# Altium project UF_Servo.PrjPcb (part 8 of 8)

## Sheet DAC.SchDoc: DAC
size A3; Author: M.Beldyga; CompanyName: WUT ISE; DrawnBy: M.Beldyga; Organization: WUT ISE; Address1: PW ISE; Address2: Nowowiejska 15/19 00-665 Warsaw; Address3: micbeldyga@gmail.com; SheetNumber: 5; SheetTotal: 12; ModifiedBy: -; CheckedDate: -; Title2: 12b 16ch; DivGrp: WUT ISE; Designer: M.Beldyga; ModifiedDate: -; ProjectName: Sensor Box
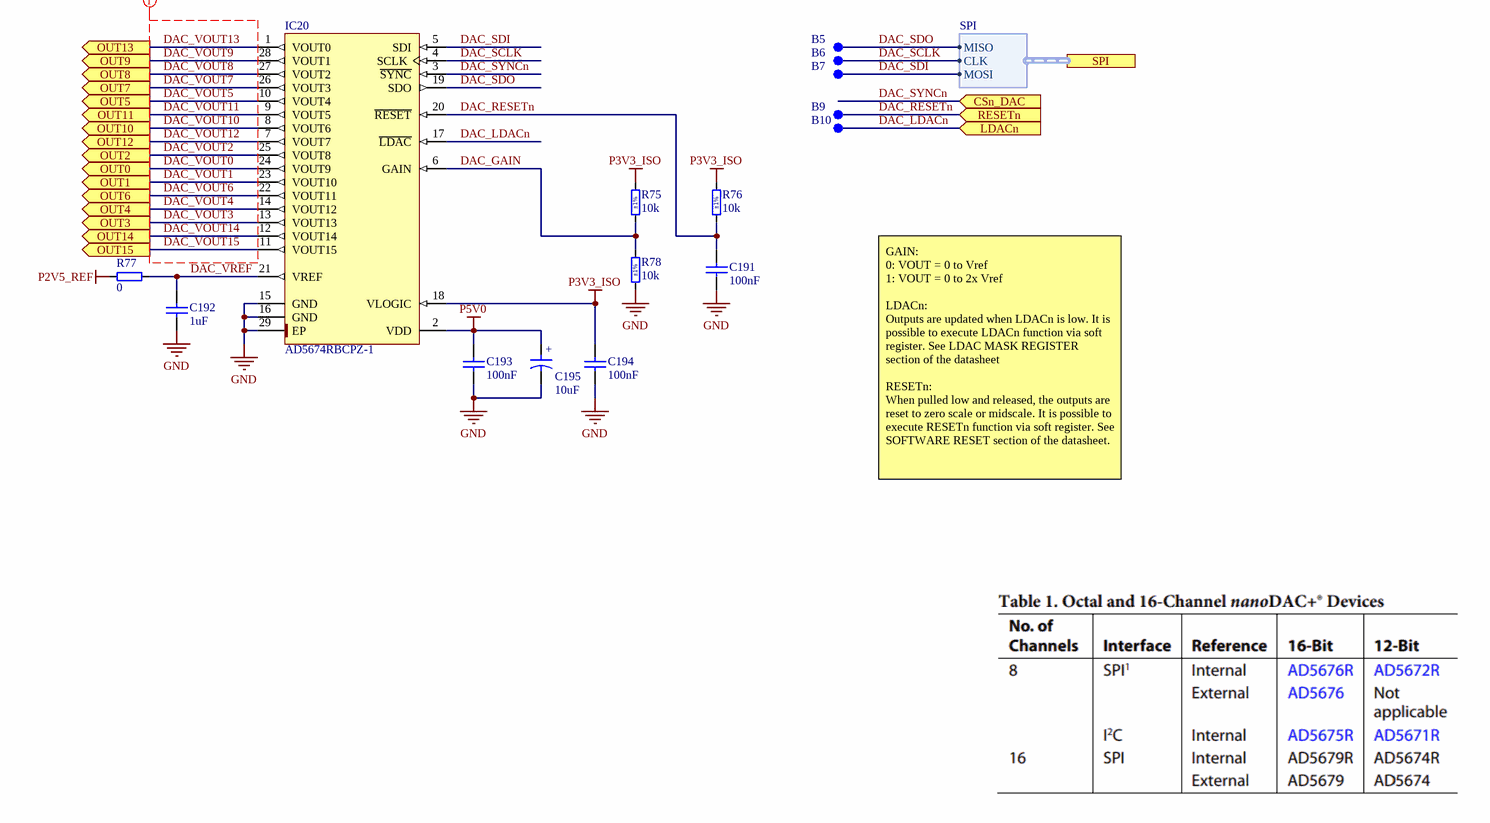
[diagram p11: DAC.SchDoc]

### Parts
B5  SMD Pad  [C100]  (value not drawn)  (no BOM)
B6  SMD Pad  [C100]  (value not drawn)  (no BOM)
B7  SMD Pad  [C100]  (value not drawn)  (no BOM)
B9  SMD Pad  [C100]  (value not drawn)  (no BOM)
B10  SMD Pad  [C100]  (value not drawn)  (no BOM)
C191  100nF  [CAPC1005X55N]
C192  1uF  [CAPC1005X55N]
C193  100nF  [CAPC1005X55N]
C194  100nF  [CAPC1005X55N]
C195  10uF  [CAPMP3216X180N]
IC20  AD5674RBCPZ-1  [QFN40P400X400X100-29N-S270]
R75  10k  Tolerance: ±1%  [RESC1005X40N]
R76  10k  Tolerance: ±1%  [RESC1005X40N]
R77  0  [RESC1005X40N]
R78  10k  Tolerance: ±1%  [RESC1005X40N]

### Ports
CSn_DAC (in), LDACn (in), OUT0 (out), OUT1 (out), OUT2 (out), OUT3 (out), OUT4 (out), OUT5 (out), OUT6 (out), OUT7 (out), OUT8 (out), OUT9 (out), OUT10 (out), OUT11 (out), OUT12 (out), OUT13 (out), OUT14 (out), OUT15 (out), RESETn (in), SPI (harness SPI)

### Harnesses
SPI: CLK, MOSI, MISO

### Nets
GND: C191.1 C192.1 C193.1 C194.1 C195.2 IC20.15(GND) IC20.16(GND) IC20.29(EP) R78.1
P2V5_REF: R77.1
P3V3_ISO: C194.2 IC20.18(VLOGIC) R75.2 R76.2
P5V0: C193.2 C195.1 IC20.2(VDD)
DAC_GAIN: IC20.6(GAIN) R75.1 R78.2
DAC_LDACn: B10.1 IC20.17(~{LDAC}) ; port LDACn
DAC_RESETn: B9.1 C191.2 IC20.20(~{RESET}) R76.1 ; port RESETn
DAC_SCLK: B6.1 IC20.4(SCLK) ; port SPI.CLK
DAC_SDI: B7.1 IC20.5(SDI) ; port SPI.MOSI
DAC_SDO: B5.1 IC20.19(SDO) ; port SPI.MISO
DAC_SYNCn: IC20.3(~{SYNC}) ; port CSn_DAC  [project net CSn_DAC]
DAC_VOUT0: IC20.24(VOUT9) ; port OUT0
DAC_VOUT1: IC20.23(VOUT10) ; port OUT1
DAC_VOUT2: IC20.25(VOUT8) ; port OUT2
DAC_VOUT3: IC20.13(VOUT13) ; port OUT3
DAC_VOUT4: IC20.14(VOUT12) ; port OUT4
DAC_VOUT5: IC20.10(VOUT4) ; port OUT5
DAC_VOUT6: IC20.22(VOUT11) ; port OUT6
DAC_VOUT7: IC20.26(VOUT3) ; port OUT7
DAC_VOUT8: IC20.27(VOUT2) ; port OUT8
DAC_VOUT9: IC20.28(VOUT1) ; port OUT9
DAC_VOUT10: IC20.8(VOUT6) ; port OUT10
DAC_VOUT11: IC20.9(VOUT5) ; port OUT11
DAC_VOUT12: IC20.7(VOUT7) ; port OUT12
DAC_VOUT13: IC20.1(VOUT0) ; port OUT13
DAC_VOUT14: IC20.12(VOUT14) ; port OUT14
DAC_VOUT15: IC20.11(VOUT15) ; port OUT15
DAC_VREF: C192.2 IC20.21(VREF) R77.2

### Layout directives
net class DAC: DAC_VOUT0, DAC_VOUT1, DAC_VOUT2, DAC_VOUT3, DAC_VOUT4, DAC_VOUT5, DAC_VOUT6, DAC_VOUT7, DAC_VOUT8, DAC_VOUT9, DAC_VOUT10, DAC_VOUT11, DAC_VOUT12, DAC_VOUT13, DAC_VOUT14, DAC_VOUT15

### Notes on the sheet
- GAIN:
  0: VOUT = 0 to Vref
  1: VOUT = 0 to 2x Vref
  LDACn:
  Outputs are updated when LDACn is low. It is possible to execute LDACn function via soft register. See LDAC MASK REGISTER section of the datasheet
  RESETn:
  When pulled low and released, the outputs are reset to zero scale or midscale. It is possible to execute RESETn function via soft register. See SOFTWARE RESET section of the datasheet.
- Project/Equipment
- Document
- Designer
- Drawn by
- Check.by
- Contact
- File
- Last Mod.
- Print Date
- Sheet
- Size
- A3
- of
- Rev
- (in symbol CTE3216-18_10UF_16V_20%_AVX_TCJ) +

### Library data of the parts
B5-B7 B9 B10 = SMD_PAD_D1MM: as B1-B4 on sheet Isolated_Power_supply; Part Number: SMD_PAD_D1MM; Component Type: Standard (No BOM); Pin Count: 1; Family: SMD Pad; Socket: No; SMD: Yes; Sense: No; Status: None; ComponentHeight: 0mm; HelpURL: Undefined; Author: CERN DEM JLC; CreateDate: 10/10/2017; LatestRevisionDate: 10/10/2017; PackageDescription: 1mm Diameter SMD Pad
C191 C193 C194 = CC0402_100NF_50V_10%_X7R: Non-polarised capacitor; Part Description: SMD Multilayer Chip Ceramic Capacitor; Manufacturer: GENERIC; Manufacturer1 Part Number: GRM155R71H104KE14D; Voltage: 50V; TC: X7R; Tolerance: ±10%; Part Number: CC0402_100NF_50V_10%_X7R; Component Kind: Standard; Component Type: Standard; Pin Count: 2; Value: 100nF; Status: None; Manufacturer Part Number: CC0402_100NF_50V_10%_X7R; Case: 0402; Mounted: Yes; Socket: No; SMD: Yes; Sense: No; Manufacturer1 Example: MURATA; Manufacturer1 ComponentHeight: 0.55mm; HelpURL: \\cern.ch\dfs\Applications\Altium\Datasheets\CC0402_MURATA_GRM155R71H104KE14D.pdf; Author: CERN DEM MR; CreateDate: 6/30/2017; LatestRevisionDate: 6/30/2017
C192 = CC0402_1UF_16V_10%_X5R: Non-polarised capacitor; Part Description: SMD Multilayer Chip Ceramic Capacitor; Manufacturer: GENERIC; Manufacturer1 Part Number: C1005X5R1C105KT; Voltage: 16V; TC: X5R; Tolerance: ±10%; Part Number: CC0402_1UF_16V_10%_X5R; Component Kind: Standard; Component Type: Standard; Pin Count: 2; Value: 1uF; Status: Preferred; Manufacturer Part Number: CC0402_1UF_16V_10%_X5R; Case: 0402; Mounted: Yes; Socket: No; SMD: Yes; Sense: No; Manufacturer1 Example: TDK; Manufacturer1 ComponentHeight: 0.55mm; HelpURL: \\cern.ch\dfs\Applications\Altium\Datasheets\CC0402_X5R_TDK_C.pdf; Author: CERN DEM JLC; CreateDate: 10/25/2012; LatestRevisionDate: 10/25/2012
C195 = CTE3216-18_10UF_16V_20%_AVX_TCJ: Polarised capacitor; Part Description: ESR 0R200 Tantalum Solid Electrolytic Chip Capacitor with Conductive Polymer Electrode; Manufacturer: AVX; Manufacturer Part Number: TCJA106M016R0200; Voltage: 16V; Tolerance: ±20%; Part Number: CTE3216-18_10UF_16V_20%_AVX_TCJ; Component Kind: Standard; Component Type: Standard; Pin Count: 2; Value: 10uF; Status: Preferred; Case: A; Mounted: Yes; Socket: No; SMD: Yes; Sense: No; ComponentHeight: 1.8mm; HelpURL: \\cern.ch\dfs\Applications\Altium\Datasheets\CTE_AVX_TCJ.pdf; Author: CERN DEM JLC; CreateDate: 29.03.2012; LatestRevisionDate: 29.03.2012
IC20 = AD5674RBCPZ-1: 12-Bit nanoDAC+ with 2 ppm/°C Voltage Reference Temperature Coefficient, SPI Interface; Manufacturer: ANALOG DEVICES; PressFit: No; Bonding: No; Part Number: AD5674RBCPZ-1; Component Kind: Standard; Component Type: Standard; Device: AD5674RBCPZ-1; PackageDescription: QFN, 0.40mm Pitch, Square; 28 Pin, 4.00mm L X 4.00mm W X 1.00mm H body (w/Thermal Tab 2.70 X 2.70mm), IPC Medium Density; Part Description: 12-Bit nanoDAC+ with 2 ppm/°C Voltage Reference Temperature Coefficient, SPI Interface; Manufacturer Part Number: AD5674RBCPZ-1; Pin Count: 28; Case: QFN28; Mounted: Yes; Socket: No; SMD: Yes; Sense: No; ComponentHeight: 1.0mm; Author: CERN DEM HF; HelpURL: \\cern.ch\dfs\Applications\Altium\Datasheets\AD5674RBCPZ-1.pdf; CreateDate: 4/19/2022; LatestRevisionDate: 4/19/2022
R75 R76 R78 = R0402_10K_1%_0.0625W_100PPM: Resistor - 1%; Part Description: General Purpose Thick Film Chip Resistor; Manufacturer: GENERIC; Manufacturer1 Part Number: 232270671003L; TC: ±100ppm/°C; PressFit: No; Part Number: R0402_10K_1%_0.0625W_100PPM; Component Kind: Standard; Component Type: Standard; Pin Count: 2; Value: 10k; Status: Not Recommended; Power: 0.0625W; Manufacturer Part Number: R0402_10K_1%_0.0625W_100PPM; Case: 0402; Mounted: Yes; Sense: No; Socket: No; SMD: Yes; Manufacturer1 Example: YAGEO PHYCOMP; Manufacturer1 ComponentHeight: 0.4mm; HelpURL: \\cern.ch\dfs\Applications\Altium\Datasheets\R0402_Phycomp_RC0402.pdf; Author: CERN DEM JLC; CreateDate: 12/3/2007; LatestRevisionDate: 10/17/2012
R77 = R0402_0R_JUMPER: Resistor; Part Description: 1A (0.05R Max DC Resistance) Zero Ohm Jumper; Manufacturer: GENERIC; Manufacturer1 Part Number: 232270591001L; PressFit: No; Part Number: R0402_0R_JUMPER; Component Kind: Standard; Component Type: Standard; Pin Count: 2; Value: 0; Status: Not Recommended; Manufacturer Part Number: R0402_0R_JUMPER; Case: 0402; Mounted: Yes; Sense: No; Socket: No; SMD: Yes; Manufacturer1 Example: YAGEO PHYCOMP; Manufacturer1 ComponentHeight: 0.4mm; HelpURL: \\cern.ch\dfs\Applications\Altium\Datasheets\R0402_Phycomp_RC0402.pdf; Author: CERN DEM JLC; CreateDate: 12/3/2007; LatestRevisionDate: 10/17/2012

## Sheet Phase_Detector.SchDoc: Phase detector
size A3; Author: M.Beldyga; CompanyName: WUT ISE; DrawnBy: M.Beldyga; Organization: WUT ISE; Address1: PW ISE; Address2: Nowowiejska 15/19 00-665 Warsaw; Address3: micbeldyga@gmail.com; SheetNumber: 12; SheetTotal: 12; ModifiedBy: -; CheckedDate: -; DivGrp: WUT ISE; Designer: M.Beldyga; ModifiedDate: -; ProjectName: Sensor Box
Used 2 times, as channels U_Phase_Detector, U_Phase_Detector. Parts and nets are listed once, with the designators drawn on the sheet.
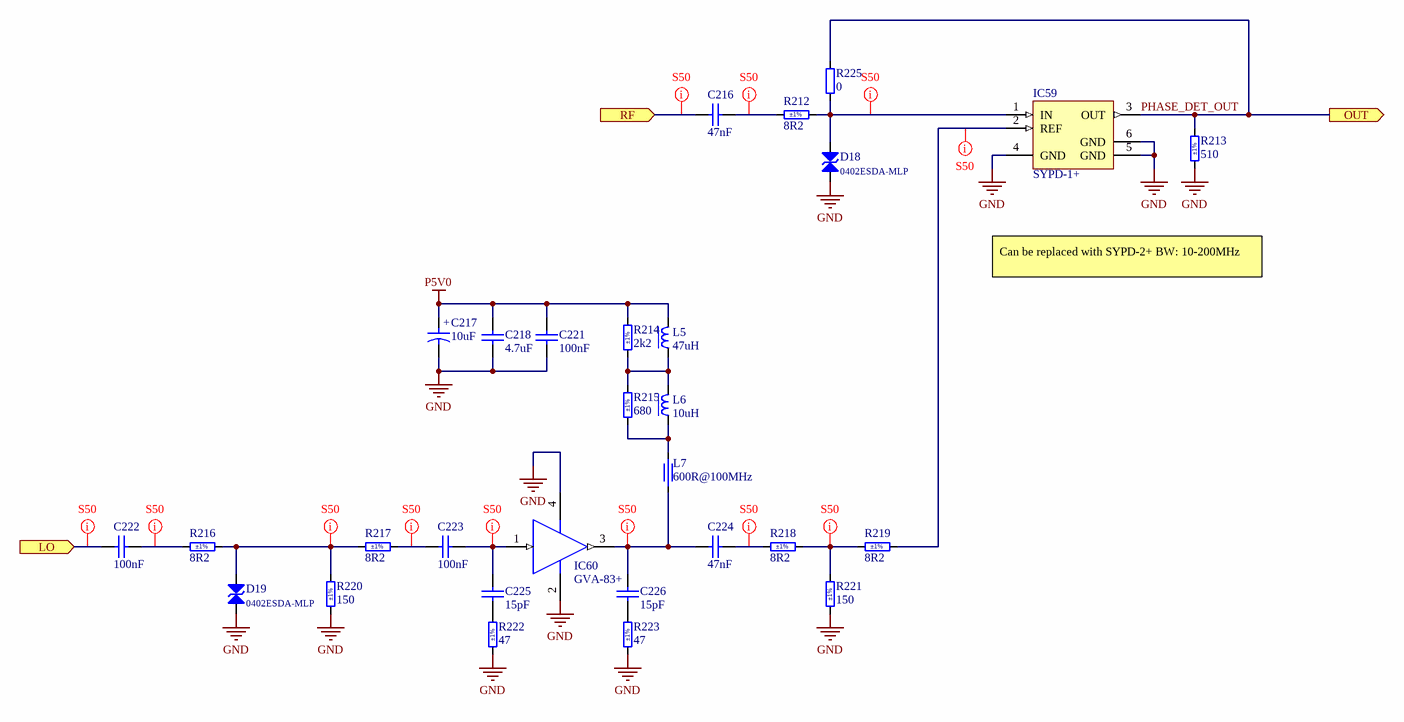
[diagram p12: Phase_Detector.SchDoc]

### Parts
C216  47nF  [CAPC1005X55N]
C217  10uF  [CAPMP3216X180N]
C218  4.7uF  [CAPC1608X90N]
C221  100nF  [CAPC1005X55N]
C222  100nF  [CAPC1005X55N]
C223  100nF  [CAPC1005X55N]
C224  47nF  [CAPC1005X55N]
C225  15pF  [CAPC1005X55N]
C226  15pF  [CAPC1005X55N]
D18  0402ESDA-MLP  [EATON_0402ESDA-MLP]
D19  0402ESDA-MLP  [EATON_0402ESDA-MLP]
IC59  SYPD-1+  [MINI-CIRCUITS_TTT167]
IC60  GVA-83+  [MINI-CIRCUITS_DF782]
L5  47uH  [IND_MURATA_LQH32C]
L6  10uH  [IND_MURATA_LQH32C]
L7  600R@100MHz  [INDC1608X95N]
R212  8R2  Tolerance: ±1%  [RESC2012X60N]
R213  510  Tolerance: ±1%  [RESC1005X40N]
R214  2k2  Tolerance: ±1%  [RESC1005X40N]
R215  680  Tolerance: ±1%  [RESC1005X40N]
R216  8R2  Tolerance: ±1%  [RESC2012X60N]
R217  8R2  Tolerance: ±1%  [RESC2012X60N]
R218  8R2  Tolerance: ±1%  [RESC2012X60N]
R219  8R2  Tolerance: ±1%  [RESC2012X60N]
R220  150  Tolerance: ±1%  [RESC2012X60N]
R221  150  Tolerance: ±1%  [RESC2012X60N]
R222  47  Tolerance: ±1%  [RESC1005X40N]
R223  47  Tolerance: ±1%  [RESC1005X40N]
R225  0  [RESC1005X40N]

### Ports
LO (in), OUT (out), RF (in)

### Nets
GND: C217.2 C218.1 C221.2 D18.1 D19.1 IC59.4(GND) IC59.5(GND) IC59.6(GND) IC60.2(GND) IC60.4(GND) R213.1 R220.1 R221.1 R222.1 R223.1
P5V0: C217.1 C218.2 C221.1 L5.2 R214.2
LO: C222.2 ; port LO
PHASE_DET_OUT: IC59.3(OUT) R213.2 R225.2 ; port OUT
RF: C216.1 ; port RF
NetC216_2: C216.2 R212.1
NetC222_1: C222.1 R216.1
NetC223_1: C223.1 C225.2 IC60.1(RF_IN)
NetC223_2: C223.2 R217.2
NetC224_1: C224.1 C226.2 IC60.3(RF_OUT) L7.1
NetC224_2: C224.2 R218.1
NetC225_1: C225.1 R222.2
NetC226_1: C226.1 R223.2
NetD18_2: D18.2 IC59.1(IN) R212.2 R225.1
NetD19_2: D19.2 R216.2 R217.1 R220.2
NetIC59_2: IC59.2(REF) R219.2
NetL5_1: L5.1 L6.2 R214.1 R215.2
NetL6_1: L6.1 L7.2 R215.1
NetR218_2: R218.2 R219.1 R221.2

### Channels
U_Phase_Detector: designators C216=C216B C217=C217B C218=C218B C221=C221B C222=C222B C223=C223B C224=C224B C225=C225B C226=C226B D18=D18B D19=D19B IC59=IC59B IC60=IC60A L5=L5B L6=L6B L7=L7B R212=R212B R213=R213B R214=R214B R215=R215B R216=R216B R217=R217B R218=R218B R219=R219B R220=R220B R221=R221B R222=R222B R223=R223B R225=R225B; ports LO=LO_IN_B OUT=PHASE_DET_OUT RF=RF_IN_B
U_Phase_Detector: designators C216=C216A C217=C217A C218=C218A C221=C221A C222=C222A C223=C223A C224=C224A C225=C225A C226=C226A D18=D18A D19=D19A IC59=IC59A IC60=IC60B L5=L5A L6=L6A L7=L7A R212=R212A R213=R213A R214=R214A R215=R215A R216=R216A R217=R217A R218=R218A R219=R219A R220=R220A R221=R221A R222=R222A R223=R223A R225=R225A; ports LO=LO_IN_A OUT=PHASE_DET_OUT RF=RF_IN_A

### Layout directives
net class S50: LO_IN_B, NetC216B_2, NetC222B_1, NetC223B_1, NetC223B_2, NetC224B_1, NetC224B_2, NetD18B_2, NetD19B_2, NetIC59B_2, NetR218B_2, RF_IN_B

### Notes on the sheet
- Can be replaced with SYPD-2+ BW: 10-200MHz
- Project/Equipment
- Document
- Designer
- Drawn by
- Check.by
- Contact
- File
- Last Mod.
- Print Date
- Sheet
- Size
- A3
- of
- Rev
- (in symbol CTE3216-18_10UF_10V_10%_LESR1800) +

### Library data of the parts
C216 C224 = CC0402_47NF_25V_10%_X7R: Non-polarised capacitor; Part Description: SMD Multilayer Chip Ceramic Capacitor; Manufacturer: GENERIC; Manufacturer1 Part Number: C1005X7R1E473K050; Voltage: 25V; TC: X7R; Tolerance: ±10%; Part Number: CC0402_47NF_25V_10%_X7R; Component Kind: Standard; Component Type: Standard; Pin Count: 2; Value: 47nF; Status: Preferred; Manufacturer Part Number: CC0402_47NF_25V_10%_X7R; Case: 0402; Mounted: Yes; Socket: No; SMD: Yes; Sense: No; Manufacturer1 Example: TDK; Manufacturer1 ComponentHeight: 0.55mm; HelpURL: \\cern.ch\dfs\Applications\Altium\Datasheets\CC0402_X7R_TDK_C.pdf; Author: CERN DEM JLC; CreateDate: 10/25/2012; LatestRevisionDate: 10/25/2012
C217 = CTE3216-18_10UF_10V_10%_LESR1800: Polarised capacitor; Part Description: Low ESR 1R8 Solid Tantalum Chip Capacitor; Manufacturer: GENERIC; Manufacturer1 Part Number: TPSA106K010R1800; Voltage: 10V; Tolerance: ±10%; Part Number: CTE3216-18_10UF_10V_10%_LESR1800; Component Kind: Standard; Component Type: Standard; Pin Count: 2; Value: 10uF; Status: Preferred; Manufacturer Part Number: CTE3216-18_10UF_10V_10%_LESR1800; Case: A; Mounted: Yes; Socket: No; SMD: Yes; Sense: No; Manufacturer1 Example: AVX; Manufacturer1 ComponentHeight: 1.8mm; HelpURL: \\cern.ch\dfs\Applications\Altium\Datasheets\CTE-LESR_AVX_TPS.pdf; Author: CERN DEM JLC; CreateDate: 5/5/2008; LatestRevisionDate: 1/20/2009
C218 = CC0603_4.7UF_25V_10%_X5R: Non-polarised capacitor; Part Description: SMD Multilayer Chip Ceramic Capacitor; Manufacturer: GENERIC; Manufacturer1 Part Number: GRM188R61E475KE11D; Voltage: 25V; TC: X5R; Tolerance: ±10%; Part Number: CC0603_4.7UF_25V_10%_X5R; Component Kind: Standard; Component Type: Standard; Pin Count: 2; Value: 4.7uF; Status: None; Manufacturer Part Number: CC0603_4.7UF_25V_10%_X5R; Case: 0603; Mounted: Yes; Socket: No; SMD: Yes; Sense: No; Manufacturer1 Example: MURATA; Manufacturer1 ComponentHeight: 0.95mm; HelpURL: \\cern.ch\dfs\Applications\Altium\Datasheets\CC0603_MURATA_GRM188R61E475KE11D.pdf; Author: CERN DEM JLC; CreateDate: 11/10/2014; LatestRevisionDate: 11/10/2014
C221-C223 = CC0402_100NF_50V_10%_X7R: as C191 on sheet DAC; Part Number: CC0402_100NF_50V_10%_X7R; Component Kind: Standard; Component Type: Standard; Pin Count: 2; Value: 100nF; Status: None; Manufacturer Part Number: CC0402_100NF_50V_10%_X7R; Case: 0402; Mounted: Yes; Socket: No; SMD: Yes; Sense: No; Manufacturer1 Example: MURATA; Manufacturer1 ComponentHeight: 0.55mm; HelpURL: \\cern.ch\dfs\Applications\Altium\Datasheets\CC0402_MURATA_GRM155R71H104KE14D.pdf; Author: CERN DEM MR; CreateDate: 6/30/2017; LatestRevisionDate: 6/30/2017
C225 C226 = CC0402_15PF_50V_5%_C0G: Non-polarised capacitor; Part Description: SMD Multilayer Chip Ceramic Capacitor; Manufacturer: GENERIC; Manufacturer1 Part Number: C0402C150J5GACTU; Voltage: 50V; TC: C0G/NP0; Tolerance: ±5%; Part Number: CC0402_15PF_50V_5%_C0G; Component Kind: Standard; Component Type: Standard; Pin Count: 2; Value: 15pF; Status: Preferred; Manufacturer Part Number: CC0402_15PF_50V_5%_C0G; Case: 0402; Mounted: Yes; Socket: No; SMD: Yes; Sense: No; Manufacturer1 Example: KEMET; Manufacturer1 ComponentHeight: 0.55mm; HelpURL: \\cern.ch\dfs\Applications\Altium\Datasheets\CC0402_C0G_KEMET_(Commercial Grade).pdf; Author: CERN DEM JLC; CreateDate: 12/3/2007; LatestRevisionDate: 4/22/2015
D18 D19 = 0402ESDA-MLP: Transient Voltage Suppressor Diode (Bi-Directional); Part Description: 0.05pF 8kV Bidirectional ESD Voltage Suppressor; Manufacturer: EATON; Voltage: 8kV; PressFit: No; Bonding: No; Part Number: 0402ESDA-MLP; Component Kind: Standard; Component Type: Standard; Device: 0402ESDA-MLP; PackageDescription: 0402, 2-Leads, Body 1.1mm L X 0.53mm W X 0.44mm H body, IPC Medium Density; Manufacturer Part Number: 0402ESDA-MLP; Pin Count: 2; Case: 0402; Mounted: Yes; Socket: No; SMD: Yes; Sense: No; ComponentHeight: 0.44mm; HelpURL: \\cern.ch\dfs\Applications\Altium\Datasheets\0402ESDA-MLP.pdf; Author: CERN DEM MR; CreateDate: 11/22/2019; LatestRevisionDate: 11/22/2019
IC59 = SYPD-1+: 50 Ohm, 1 to 100MHz, High Output, Phase Detector; Manufacturer: MINI-CIRCUITS; Manufacturer Part Number: SYPD-1; PressFit: No; Bonding: No; Part Number: SYPD-1+; Component Kind: Standard; Component Type: Standard; Device: SYPD-1+; PackageDescription: MINI-CIRCUITS TTT167 Case, 6 pin, 9.65mm W X 12.7mm L; Part Description: 50 Ohm, 1 to 100MHz, High Output, Phase Detector; Pin Count: 6; Mounted: Yes; Socket: No; SMD: Yes; Sense: No; ComponentHeight: 5.84mm; Author: CERN DEM BC; HelpURL: \\cern.ch\dfs\Applications\Altium\Datasheets\SYPD-1+.pdf; CreateDate: 1/23/2020; LatestRevisionDate: 6/24/2022
IC60 = GVA-83+: Monolithic Amplifier DC-7 GHz; Manufacturer: Mini-Circuits; Supplier: Digikey; Supplier Part Number: 3157-GVA-83+CT-ND; Manufacturer Part Number: GVA-83+; RoHS: Yes; Category: RF Amplifiers; Stock: 563; Pricing: 1=3.04, 20=2.76, 100=2.724, 200=2.592, 500=2.5857 (USD); RoHS Compliant: Yes; ComponentLink1URL: http://datasheet.octopart.com/GVA-83%2B-Mini-Circuits-datasheet-15989876.pdf?src-supplier=Digikey; ComponentLink1Description: http://datasheet.octopart.com/GVA-83%2B-Mini-Circuits-datasheet-15989876.pdf?src-supplier=Digikey; ComponentLink2URL: http://datasheet.octopart.com/GVA-83%2B-Mini-Circuits-datasheet-15989876.pdf?src-supplier=Mouser; ComponentLink2Description: http://datasheet.octopart.com/GVA-83%2B-Mini-Circuits-datasheet-15989876.pdf?src-supplier=Mouser; ComponentLink3URL: http://datasheet.octopart.com/GVA-83%2B-Mini-Circuits-datasheet-15989876.pdf?src-supplier=Quest; ComponentLink3Description: http://datasheet.octopart.com/GVA-83%2B-Mini-Circuits-datasheet-15989876.pdf?src-supplier=Quest
L5 = IND_47UH_10%_MURATA_LQH32CN470K23L: Inductor With Core; Part Description: Chip Inductor (Chip Coil) for Choke Wire Wound Type; Manufacturer: MURATA; Power: 170mA; Resistance: 1.3R; Tolerance: ±10%; Part Number: IND_47UH_10%_MURATA_LQH32CN470K23L; Component Kind: Standard; Component Type: Standard; Pin Count: 2; Value: 47uH; Manufacturer Part Number: LQH32CN470K23; Mounted: Yes; Socket: No; SMD: Yes; Sense: No; ComponentHeight: 2.2mm; HelpURL: \\cern.ch\dfs\Applications\Altium\Datasheets\IND_MURATA_LQH32CN_23.pdf; Author: CERN DEM JLC; CreateDate: 1/20/2009; LatestRevisionDate: 7/4/2018
L6 = IND_10UH_10%_MURATA_LQH32CN100K33L: Inductor With Core; Part Description: Chip Inductor (Chip Coil) for Choke Wire Wound Type; Manufacturer: MURATA; Power: 450mA; Resistance: 0.3R; Tolerance: ±10%; Part Number: IND_10UH_10%_MURATA_LQH32CN100K33L; Component Kind: Standard; Component Type: Standard; Pin Count: 2; Value: 10uH; Manufacturer Part Number: LQH32CN100K33; Mounted: Yes; Socket: No; SMD: Yes; Sense: No; ComponentHeight: 2.2mm; HelpURL: \\cern.ch\dfs\Applications\Altium\Datasheets\IND_MURATA_LQH32CN_33.pdf; Author: CERN DEM JLC; CreateDate: 4/6/2009; LatestRevisionDate: 7/4/2018
L7 = IND0603_MURATA_BLM18BD601SN1D: Part Description: SMD EMIFIL Suppression Chip Ferrite Bead; Manufacturer: MURATA; Power: 200mA; Resistance: 0.65R; Tolerance: ±25%; Part Number: IND0603_MURATA_BLM18BD601SN1D; Component Kind: Standard; Component Type: Standard; Pin Count: 2; Value: 600R@100MHz; Manufacturer Part Number: BLM18BD601SN1D; Case: 0603; Mounted: Yes; Socket: No; SMD: Yes; Sense: No; ComponentHeight: 0.95mm; HelpURL: \\cern.ch\dfs\Applications\Altium\Datasheets\IND0603_MURATA_BLM18B.pdf; Author: CERN DEM JLC; CreateDate: 7/4/2012; LatestRevisionDate: 10/25/2018
R212 R216-R219 = R0805_8R2_1%_0.125W_200PPM: Resistor - 1%; Part Description: General Purpose Thick Film Chip Resistor; Manufacturer: GENERIC; Manufacturer1 Part Number: 232273468208L or RC0805FR-078R2L; Power: 0.125W; TC: ±200ppm/°C; PressFit: No; Part Number: R0805_8R2_1%_0.125W_200PPM; Component Kind: Standard; Component Type: Standard; Pin Count: 2; Value: 8R2; Status: Preferred; Manufacturer Part Number: R0805_8R2_1%_0.125W_200PPM; Case: 0805; Mounted: Yes; Sense: No; Socket: No; SMD: Yes; Manufacturer1 Example: YAGEO PHYCOMP; Manufacturer1 ComponentHeight: 0.65mm; HelpURL: \\cern.ch\dfs\Applications\Altium\Datasheets\R0805_Phycomp_RC0805.pdf; Author: CERN DEM JLC; CreateDate: 12/3/2007; LatestRevisionDate: 10/17/2012
R213 = R0402_510R_1%_0.0625W_100PPM: Resistor - 1%; Part Description: General Purpose Thick Film Chip Resistor; Manufacturer: GENERIC; Manufacturer1 Part Number: 232270675101L; TC: ±100ppm/°C; PressFit: No; Part Number: R0402_510R_1%_0.0625W_100PPM; Component Kind: Standard; Component Type: Standard; Pin Count: 2; Value: 510; Status: Not Recommended; Power: 0.0625W; Manufacturer Part Number: R0402_510R_1%_0.0625W_100PPM; Case: 0402; Mounted: Yes; Sense: No; Socket: No; SMD: Yes; Manufacturer1 Example: YAGEO PHYCOMP; Manufacturer1 ComponentHeight: 0.4mm; HelpURL: \\cern.ch\dfs\Applications\Altium\Datasheets\R0402_Phycomp_RC0402.pdf; Author: CERN DEM JLC; CreateDate: 12/3/2007; LatestRevisionDate: 10/17/2012
R214 = R0402_2K2_1%_0.0625W_100PPM: Resistor - 1%; Part Description: General Purpose Thick Film Chip Resistor; Manufacturer: GENERIC; Manufacturer1 Part Number: 232270672202L; TC: ±100ppm/°C; PressFit: No; Part Number: R0402_2K2_1%_0.0625W_100PPM; Component Kind: Standard; Component Type: Standard; Pin Count: 2; Value: 2k2; Status: Not Recommended; Power: 0.0625W; Manufacturer Part Number: R0402_2K2_1%_0.0625W_100PPM; Case: 0402; Mounted: Yes; Sense: No; Socket: No; SMD: Yes; Manufacturer1 Example: YAGEO PHYCOMP; Manufacturer1 ComponentHeight: 0.4mm; HelpURL: \\cern.ch\dfs\Applications\Altium\Datasheets\R0402_Phycomp_RC0402.pdf; Author: CERN DEM JLC; CreateDate: 12/3/2007; LatestRevisionDate: 10/17/2012
R215 = R0402_680R_1%_0.0625W_100PPM: Resistor - 1%; Part Description: General Purpose Thick Film Chip Resistor; Manufacturer: GENERIC; Manufacturer1 Part Number: 232270676801L; TC: ±100ppm/°C; PressFit: No; Part Number: R0402_680R_1%_0.0625W_100PPM; Component Kind: Standard; Component Type: Standard; Pin Count: 2; Value: 680; Status: Not Recommended; Power: 0.0625W; Manufacturer Part Number: R0402_680R_1%_0.0625W_100PPM; Case: 0402; Mounted: Yes; Sense: No; Socket: No; SMD: Yes; Manufacturer1 Example: YAGEO PHYCOMP; Manufacturer1 ComponentHeight: 0.4mm; HelpURL: \\cern.ch\dfs\Applications\Altium\Datasheets\R0402_Phycomp_RC0402.pdf; Author: CERN DEM JLC; CreateDate: 12/3/2007; LatestRevisionDate: 10/17/2012
R220 R221 = R0805_150R_1%_0.125W_100PPM: Resistor - 1%; Part Description: General Purpose Thick Film Chip Resistor; Manufacturer: GENERIC; Manufacturer1 Part Number: NRC10F1500TRF; Power: 0.125W; TC: ±100ppm/°C; PressFit: No; Part Number: R0805_150R_1%_0.125W_100PPM; Component Kind: Standard; Component Type: Standard; Pin Count: 2; Value: 150; Status: Preferred; Manufacturer Part Number: R0805_150R_1%_0.125W_100PPM; Case: 0805; Mounted: Yes; Sense: No; Socket: No; SMD: Yes; Manufacturer1 Example: NIC COMPONENT; Manufacturer1 ComponentHeight: 0.6mm; HelpURL: \\cern.ch\dfs\Applications\Altium\Datasheets\R0805_NIC_NRC.pdf; Author: CERN DEM JLC; CreateDate: 12/3/2007; LatestRevisionDate: 3/13/2008
R222 R223 = R0402_47R_1%_0.0625W_100PPM: Resistor - 1%; Part Description: General Purpose Thick Film Chip Resistor; Manufacturer: GENERIC; Manufacturer1 Part Number: 232270674709L; TC: ±100ppm/°C; PressFit: No; Part Number: R0402_47R_1%_0.0625W_100PPM; Component Kind: Standard; Component Type: Standard; Pin Count: 2; Value: 47; Status: Not Recommended; Power: 0.0625W; Manufacturer Part Number: R0402_47R_1%_0.0625W_100PPM; Case: 0402; Mounted: Yes; Sense: No; Socket: No; SMD: Yes; Manufacturer1 Example: YAGEO PHYCOMP; Manufacturer1 ComponentHeight: 0.4mm; HelpURL: \\cern.ch\dfs\Applications\Altium\Datasheets\R0402_Phycomp_RC0402.pdf; Author: CERN DEM JLC; CreateDate: 12/3/2007; LatestRevisionDate: 10/17/2012
R225 = R0402_0R_JUMPER: as R77 on sheet DAC; Part Number: R0402_0R_JUMPER; Component Kind: Standard; Component Type: Standard; Pin Count: 2; Value: 0; Status: Not Recommended; Manufacturer Part Number: R0402_0R_JUMPER; Case: 0402; Mounted: Yes; Sense: No; Socket: No; SMD: Yes; Manufacturer1 Example: YAGEO PHYCOMP; Manufacturer1 ComponentHeight: 0.4mm; HelpURL: \\cern.ch\dfs\Applications\Altium\Datasheets\R0402_Phycomp_RC0402.pdf; Author: CERN DEM JLC; CreateDate: 12/3/2007; LatestRevisionDate: 10/17/2012

## Nets that join several sheets
GND: UF_Servo (9 pins), U_PID (57 pins), U_PID/U_Cap_Array_100p_400n (12 pins), U_PID/U_Cap_Array_100p_400n (12 pins), U_PID/U_Cap_Array_100p_400n (12 pins), U_PID/U_Cap_Array_100p_400n (42 pins), U_PID/U_Cap_Array_100p_16u (15 pins), IO_Expander (36 pins), CPCIS_Connectors_P1_P6 (66 pins), Data_Interface (13 pins), Optocouplers (54 pins), EEM_Connectors (36 pins), Isolated_Power_supply (84 pins), DAC (9 pins), U_PID (57 pins), U_PID/U_Cap_Array_100p_400n (12 pins), U_PID/U_Cap_Array_100p_400n (12 pins), U_PID/U_Cap_Array_100p_400n (12 pins), U_PID/U_Cap_Array_100p_400n (42 pins), U_PID/U_Cap_Array_100p_16u (15 pins), U_Phase_Detector (15 pins), U_Phase_Detector (15 pins)
N5V0: U_PID (25 pins), U_PID/U_Cap_Array_100p_400n (6 pins), U_PID/U_Cap_Array_100p_400n (6 pins), U_PID/U_Cap_Array_100p_400n (6 pins), U_PID/U_Cap_Array_100p_400n (6 pins), U_PID/U_Cap_Array_100p_16u (8 pins), Isolated_Power_supply (5 pins), U_PID (25 pins), U_PID/U_Cap_Array_100p_400n (6 pins), U_PID/U_Cap_Array_100p_400n (6 pins), U_PID/U_Cap_Array_100p_400n (6 pins), U_PID/U_Cap_Array_100p_400n (6 pins), U_PID/U_Cap_Array_100p_16u (8 pins)
P2V5_REF: U_PID (R36B.1 R70B.1), Isolated_Power_supply (B4.1 C214.2 IC55.6 IC55.7), DAC (R77.1), U_PID (R36A.1 R70A.1)
P3V3: Data_Interface (8 pins), Optocouplers (17 pins), EEM_Connectors (C298.2 IC40.14), Isolated_Power_supply (5 pins)
P3V3_DIOT: CPCIS_Connectors_P1_P6 (13 pins), Isolated_Power_supply (C174.1 D22.2 IC38.5)
P3V3_ISO: IO_Expander (12 pins), Data_Interface (C58.2 IC10.6 IC10.16), Optocouplers (13 pins), Isolated_Power_supply (7 pins), DAC (C194.2 IC20.18 R75.2 R76.2)
P3V3_MP: EEM_Connectors (5 pins), Isolated_Power_supply (5 pins)
P5V0: U_PID (31 pins), U_PID/U_Cap_Array_100p_400n (6 pins), U_PID/U_Cap_Array_100p_400n (6 pins), U_PID/U_Cap_Array_100p_400n (6 pins), U_PID/U_Cap_Array_100p_400n (6 pins), U_PID/U_Cap_Array_100p_16u (8 pins), Isolated_Power_supply (B1.1 C199.1 C202.2 L3.2), DAC (C193.2 C195.1 IC20.2), U_PID (31 pins), U_PID/U_Cap_Array_100p_400n (6 pins), U_PID/U_Cap_Array_100p_400n (6 pins), U_PID/U_Cap_Array_100p_400n (6 pins), U_PID/U_Cap_Array_100p_400n (6 pins), U_PID/U_Cap_Array_100p_16u (8 pins), U_Phase_Detector (5 pins), U_Phase_Detector (5 pins)
P12V0_DIOT: CPCIS_Connectors_P1_P6 (7 pins), EEM_Connectors (R257.1 R260.1 R261.1 R262.1), Isolated_Power_supply (C173.2 IC38.1 IC38.3)
P12V0_EEM: EEM_Connectors (8 pins), Isolated_Power_supply (13 pins)
BP_I2C.SCL: CPCIS_Connectors_P1_P6 (D23.3 J6.B2), EEM_Connectors (R187.1)
BP_I2C.SDA: CPCIS_Connectors_P1_P6 (D23.1 J6.C2), EEM_Connectors (R186.1)
BP_IO.LVDS_N0: CPCIS_Connectors_P1_P6 (J6.E3), EEM_Connectors (R161.1)
BP_IO.LVDS_N1: CPCIS_Connectors_P1_P6 (J6.B3), EEM_Connectors (R162.1)
BP_IO.LVDS_N2: CPCIS_Connectors_P1_P6 (J6.C4), EEM_Connectors (R163.1)
BP_IO.LVDS_N3: CPCIS_Connectors_P1_P6 (J6.L4), EEM_Connectors (R164.1)
BP_IO.LVDS_N4: CPCIS_Connectors_P1_P6 (J6.I4), EEM_Connectors (R167.1)
BP_IO.LVDS_N5: CPCIS_Connectors_P1_P6 (J6.K5), EEM_Connectors (R168.1)
BP_IO.LVDS_N6: CPCIS_Connectors_P1_P6 (J6.H5), EEM_Connectors (R169.1)
BP_IO.LVDS_N7: CPCIS_Connectors_P1_P6 (J6.F6), EEM_Connectors (R170.1)
BP_IO.LVDS_N8: CPCIS_Connectors_P1_P6 (J6.C6), EEM_Connectors (R171.1)
BP_IO.LVDS_N9: CPCIS_Connectors_P1_P6 (J6.L6), EEM_Connectors (R172.1)
BP_IO.LVDS_N10: CPCIS_Connectors_P1_P6 (J6.I6), EEM_Connectors (R173.1)
BP_IO.LVDS_N11: CPCIS_Connectors_P1_P6 (J7.E1), EEM_Connectors (R174.1)
BP_IO.LVDS_N12: CPCIS_Connectors_P1_P6 (J7.B1), EEM_Connectors (R175.1)
BP_IO.LVDS_N13: CPCIS_Connectors_P1_P6 (J7.K1), EEM_Connectors (R176.1)
BP_IO.LVDS_N14: CPCIS_Connectors_P1_P6 (J7.H1), EEM_Connectors (R177.1)
BP_IO.LVDS_N15: CPCIS_Connectors_P1_P6 (J6.F2), EEM_Connectors (R144.2)
BP_IO.LVDS_P0: CPCIS_Connectors_P1_P6 (J6.D3), EEM_Connectors (R145.1)
BP_IO.LVDS_P1: CPCIS_Connectors_P1_P6 (J6.A3), EEM_Connectors (R146.1)
BP_IO.LVDS_P2: CPCIS_Connectors_P1_P6 (J6.B4), EEM_Connectors (R147.1)
BP_IO.LVDS_P3: CPCIS_Connectors_P1_P6 (J6.K4), EEM_Connectors (R148.1)
BP_IO.LVDS_P4: CPCIS_Connectors_P1_P6 (J6.H4), EEM_Connectors (R149.1)
BP_IO.LVDS_P5: CPCIS_Connectors_P1_P6 (J6.J5), EEM_Connectors (R150.1)
BP_IO.LVDS_P6: CPCIS_Connectors_P1_P6 (J6.G5), EEM_Connectors (R151.1)
BP_IO.LVDS_P7: CPCIS_Connectors_P1_P6 (J6.E6), EEM_Connectors (R152.1)
BP_IO.LVDS_P8: CPCIS_Connectors_P1_P6 (J6.B6), EEM_Connectors (R188.1)
BP_IO.LVDS_P9: CPCIS_Connectors_P1_P6 (J6.K6), EEM_Connectors (R189.1)
BP_IO.LVDS_P10: CPCIS_Connectors_P1_P6 (J6.H6), EEM_Connectors (R190.1)
BP_IO.LVDS_P11: CPCIS_Connectors_P1_P6 (J7.D1), EEM_Connectors (R156.1)
BP_IO.LVDS_P12: CPCIS_Connectors_P1_P6 (J7.A1), EEM_Connectors (R157.1)
BP_IO.LVDS_P13: CPCIS_Connectors_P1_P6 (J7.J1), EEM_Connectors (R158.1)
BP_IO.LVDS_P14: CPCIS_Connectors_P1_P6 (J7.G1), EEM_Connectors (R159.1)
BP_IO.LVDS_P15: CPCIS_Connectors_P1_P6 (J6.E2), EEM_Connectors (R143.2)
CSn_0: Data_Interface (IC10.1), Optocouplers (IC34.8)
CSn_1: Data_Interface (IC10.2), Optocouplers (IC27.8)
CSn_2: Data_Interface (IC10.3), Optocouplers (IC29.8)
CSn_DAC: Data_Interface (B11.1 IC10.15), DAC (IC20.3)
CSn_EXP0: IO_Expander (IC39.34), Data_Interface (B17.1 IC10.9)
CSn_EXP1: IO_Expander (IC49.34), Data_Interface (B20.1 IC10.10)
CSn_EXP2: IO_Expander (IC47.34), Data_Interface (B14.1 IC10.11)
CSn_EXP3: IO_Expander (IC58.34), Data_Interface (B19.1 IC10.12)
CSn_EXP4: IO_Expander (IC48.34), Data_Interface (B13.1 IC10.13)
CSn_EXP5: IO_Expander (IC50.34), Data_Interface (B18.1 IC10.14)
DAC_LDACn: IO_Expander (IC39.2), DAC (B10.1 IC20.17)
DAC_RESETn: IO_Expander (IC39.1), DAC (B9.1 C191.2 IC20.20 R76.1)
DAC_SCLK: IO_Expander (6 pins), Optocouplers (IC28.8), DAC (B6.1 IC20.4)
DAC_SDI: IO_Expander (6 pins), Optocouplers (IC33.8), DAC (B7.1 IC20.5)
DAC_SDO: IO_Expander (6 pins), Optocouplers (R81.2), DAC (B5.1 IC20.19)
DAC_VOUT0: U_PID (R68B.1), DAC (IC20.24)
DAC_VOUT1: U_PID (R73B.1), DAC (IC20.23)
DAC_VOUT2: U_PID/U_Cap_Array_100p_400n (R62G.2 R208G.2), DAC (IC20.25)
DAC_VOUT3: U_PID/U_Cap_Array_100p_400n (R62H.2 R208H.2), DAC (IC20.13)
DAC_VOUT4: U_PID/U_Cap_Array_100p_16u (R65B.2 R210B.2), DAC (IC20.14)
DAC_VOUT5: U_PID/U_Cap_Array_100p_400n (R62F.2 R208F.2), DAC (IC20.10)
DAC_VOUT6: U_PID/U_Cap_Array_100p_400n (R62E.2 R208E.2), DAC (IC20.22)
DAC_VOUT7: DAC (IC20.26), U_PID (R68A.1)
DAC_VOUT8: DAC (IC20.27), U_PID (R73A.1)
DAC_VOUT9: DAC (IC20.28), U_PID/U_Cap_Array_100p_400n (R62C.2 R208C.2)
DAC_VOUT10: DAC (IC20.8), U_PID/U_Cap_Array_100p_400n (R62D.2 R208D.2)
DAC_VOUT11: DAC (IC20.9), U_PID/U_Cap_Array_100p_16u (R65A.2 R210A.2)
DAC_VOUT12: DAC (IC20.7), U_PID/U_Cap_Array_100p_400n (R62B.2 R208B.2)
DAC_VOUT13: DAC (IC20.1), U_PID/U_Cap_Array_100p_400n (R62A.2 R208A.2)
DIOT_CSn_0: Data_Interface (IC12.7), Optocouplers (R98.2)
DIOT_CSn_1: Data_Interface (IC12.6), Optocouplers (R82.2)
DIOT_CSn_2: Data_Interface (IC13.7), Optocouplers (R90.2)
DIOT_SPI_CLK: Data_Interface (IC11.7), Optocouplers (R89.2)
DIOT_SPI_MISO: Data_Interface (IC9.2), Optocouplers (IC26.8)
DIOT_SPI_MOSI: Data_Interface (IC11.6), Optocouplers (R97.2)
EEM0_I2C.SCL: EEM_Connectors (6 pins), Isolated_Power_supply (IC37.2)
EEM0_I2C.SDA: EEM_Connectors (6 pins), Isolated_Power_supply (IC37.1)
EEM_IO.LVDS_N8: Data_Interface (IC9.7), EEM_Connectors (J9.3 R171.2)
EEM_IO.LVDS_N9: Data_Interface (IC11.4 R26.1), EEM_Connectors (J9.6 R172.2)
EEM_IO.LVDS_N10: Data_Interface (IC11.1 R25.2), EEM_Connectors (J9.9 R173.2)
EEM_IO.LVDS_N11: Data_Interface (IC12.4 R28.1), EEM_Connectors (J9.12 R174.2)
EEM_IO.LVDS_N12: Data_Interface (IC12.1 R27.2), EEM_Connectors (J9.15 R175.2)
EEM_IO.LVDS_N13: Data_Interface (IC13.1 R29.2), EEM_Connectors (J9.18 R176.2)
EEM_IO.LVDS_P8: Data_Interface (IC9.8), EEM_Connectors (J9.2 R188.2)
EEM_IO.LVDS_P9: Data_Interface (IC11.3 R26.2), EEM_Connectors (J9.5 R189.2)
EEM_IO.LVDS_P10: Data_Interface (IC11.2 R25.1), EEM_Connectors (J9.8 R190.2)
EEM_IO.LVDS_P11: Data_Interface (IC12.3 R28.2), EEM_Connectors (J9.11 R156.2)
EEM_IO.LVDS_P12: Data_Interface (IC12.2 R27.1), EEM_Connectors (J9.14 R157.2)
EEM_IO.LVDS_P13: Data_Interface (IC13.2 R29.1), EEM_Connectors (J9.17 R158.2)
EXP0_P4: U_PID/U_Cap_Array_100p_16u (R209B.1), IO_Expander (IC39.30)
EXP0_P7: U_PID/U_Cap_Array_100p_400n (R61H.1), IO_Expander (IC39.24)
EXP0_P9: U_PID/U_Cap_Array_100p_16u (R64B.1), IO_Expander (IC39.3)
EXP0_P14: U_PID/U_Cap_Array_100p_16u (R63B.1), IO_Expander (IC39.6)
EXP0_P28: U_PID/U_Cap_Array_100p_400n (R60H.1), IO_Expander (IC39.23)
EXP0_P29: U_PID/U_Cap_Array_100p_400n (R207H.1), IO_Expander (IC39.25)
EXP1_P6: U_PID (R6B.1), IO_Expander (IC49.26)
EXP1_P7: U_PID/U_Cap_Array_100p_400n (R60F.1), IO_Expander (IC49.24)
EXP1_P23: U_PID/U_Cap_Array_100p_400n (R60E.1), IO_Expander (IC49.17)
EXP1_P24: U_PID/U_Cap_Array_100p_400n (R61E.1), IO_Expander (IC49.18)
EXP1_P25: U_PID/U_Cap_Array_100p_400n (R207E.1), IO_Expander (IC49.19)
EXP1_P28: U_PID/U_Cap_Array_100p_400n (R61F.1), IO_Expander (IC49.23)
EXP1_P29: U_PID/U_Cap_Array_100p_400n (R207F.1), IO_Expander (IC49.25)
EXP2_P22: U_PID/U_Cap_Array_100p_400n (R60G.1), IO_Expander (IC47.16)
EXP2_P23: U_PID/U_Cap_Array_100p_400n (R61G.1), IO_Expander (IC47.17)
EXP2_P24: U_PID/U_Cap_Array_100p_400n (R207G.1), IO_Expander (IC47.18)
EXP2_P25: U_PID (R32B.1), IO_Expander (IC47.19)
EXP3_P11: IO_Expander (IC58.7), U_PID/U_Cap_Array_100p_400n (R207D.1)
EXP3_P12: IO_Expander (IC58.2), U_PID/U_Cap_Array_100p_400n (R61D.1)
EXP3_P13: IO_Expander (IC58.4), U_PID/U_Cap_Array_100p_400n (R60D.1)
EXP3_P19: IO_Expander (IC58.13), U_PID/U_Cap_Array_100p_16u (R209A.1)
EXP3_P20: IO_Expander (IC58.14), U_PID/U_Cap_Array_100p_16u (R64A.1)
EXP3_P21: IO_Expander (IC58.15), U_PID/U_Cap_Array_100p_16u (R63A.1)
EXP3_P23: IO_Expander (IC58.17), U_PID (R6A.1)
EXP4_P6: IO_Expander (IC48.26), U_PID/U_Cap_Array_100p_400n (R207B.1)
EXP4_P7: IO_Expander (IC48.24), U_PID (R32A.1)
EXP4_P19: IO_Expander (IC48.13), U_PID/U_Cap_Array_100p_400n (R60C.1)
EXP4_P20: IO_Expander (IC48.14), U_PID/U_Cap_Array_100p_400n (R61C.1)
EXP4_P21: IO_Expander (IC48.15), U_PID/U_Cap_Array_100p_400n (R207C.1)
EXP4_P26: IO_Expander (IC48.21), U_PID/U_Cap_Array_100p_400n (R60B.1)
EXP4_P28: IO_Expander (IC48.23), U_PID/U_Cap_Array_100p_400n (R61B.1)
EXP5_26: IO_Expander (IC50.21), U_PID/U_Cap_Array_100p_400n (R207A.1)
EXP5_28: IO_Expander (IC50.23), U_PID/U_Cap_Array_100p_400n (R61A.1)
EXP5_29: IO_Expander (IC50.25), U_PID/U_Cap_Array_100p_400n (R60A.1)
LO_IN_A: UF_Servo (J10.1), U_Phase_Detector (C222A.2)
LO_IN_B: UF_Servo (J3.1), U_Phase_Detector (C222B.2)
NetC10A_2: U_PID (C10A.2 IC7A.2 R20A.2), U_PID/U_Cap_Array_100p_16u (38 pins)
NetC10B_2: U_PID (C10B.2 IC7B.2 R20B.2), U_PID/U_Cap_Array_100p_16u (38 pins)
NetC39B_2: U_PID (R45A.1), U_PID/U_Cap_Array_100p_400n (30 pins)
NetC39C_2: U_PID (R4A.2), U_PID/U_Cap_Array_100p_400n (30 pins)
NetC39D_2: U_PID (R9A.2), U_PID/U_Cap_Array_100p_400n (30 pins)
NetC39F_2: U_PID (R45B.1), U_PID/U_Cap_Array_100p_400n (30 pins)
NetC39G_2: U_PID (R4B.2), U_PID/U_Cap_Array_100p_400n (30 pins)
NetC39H_2: U_PID (R9B.2), U_PID/U_Cap_Array_100p_400n (30 pins)
NetIC1A_3: U_PID (IC1A.3 R7A.2), U_PID/U_Cap_Array_100p_400n (15 pins)
NetIC1B_3: U_PID (IC1B.3 R7B.2), U_PID/U_Cap_Array_100p_400n (15 pins)
NetIC15A_2: U_PID (R31A.1), U_PID/U_Cap_Array_100p_400n (15 pins)
NetIC15B_2: U_PID (R56A.1), U_PID/U_Cap_Array_100p_400n (15 pins)
NetIC15D_2: U_PID (R8A.2), U_PID/U_Cap_Array_100p_400n (15 pins)
NetIC15E_2: U_PID (R31B.1), U_PID/U_Cap_Array_100p_400n (15 pins)
NetIC15F_2: U_PID (R56B.1), U_PID/U_Cap_Array_100p_400n (15 pins)
NetIC15H_2: U_PID (R8B.2), U_PID/U_Cap_Array_100p_400n (15 pins)
NetIC21A_2: U_PID (R10A.1), U_PID/U_Cap_Array_100p_16u (19 pins)
NetIC21B_2: U_PID (R10B.1), U_PID/U_Cap_Array_100p_16u (19 pins)
PGOOD: CPCIS_Connectors_P1_P6 (R155.1 T2.1), Isolated_Power_supply (IC36.7 R140#2.1 T18.1)
PHASE_DET_OUT: U_PID (R57B.1 R58B.2), U_Phase_Detector (IC59B.3 R213B.2 R225B.2)
PHASE_DET_OUT: U_PID (R57A.1 R58A.2), U_Phase_Detector (IC59A.3 R213A.2 R225A.2)
PID_OUT: UF_Servo (J4.1), U_PID (R224B.2)
PID_OUT: UF_Servo (J11.1), U_PID (R224A.2)
PSU_EN: CPCIS_Connectors_P1_P6 (R182.2), Isolated_Power_supply (IC36.8 R134#2.1 R135#2.2 R193.2)
RF_IN_A: UF_Servo (J5.1), U_Phase_Detector (C216A.1)
RF_IN_B: UF_Servo (J1.1), U_Phase_Detector (C216B.1)
SERVMOD_3V3: CPCIS_Connectors_P1_P6 (R138.1 R153.2), EEM_Connectors (IC40.5 IC40.6 IC40.12 IC40.13)

## Assembly variants
DIOT: not fitted R78 R225A R225B
EEM: not fitted R78 R225A R225B